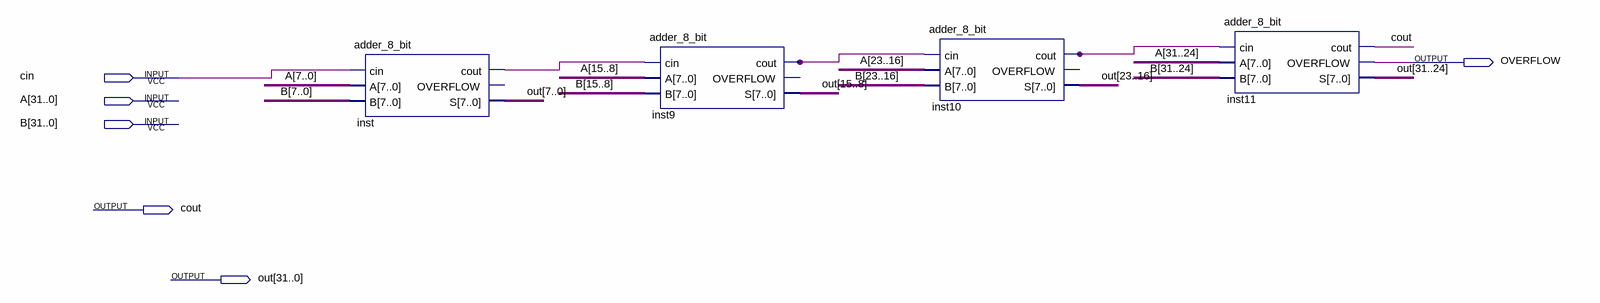
[diagram p0: schematic sheet]
// Quartus schematic adder_32_bit.bdf as structural Verilog: 4 symbols, 6 pins
module adder_32_bit (
  input  cin,
  input  [31:0] A,
  input  [31:0] B,
  output OVERFLOW,
  output cout,
  output [31:0] out
);

  wire inst9_cout, inst10_cout, inst_cout;

  adder_8_bit inst (.cin(cin), .A(A[7:0]), .B(B[7:0]), .cout(inst_cout), .S(out[7:0]));  // open: OVERFLOW
  adder_8_bit inst9 (.cin(inst_cout), .A(A[15:8]), .B(B[15:8]), .cout(inst9_cout), .S(out[15:8]));  // open: OVERFLOW
  adder_8_bit inst10 (
    .cin(inst9_cout), .A(A[23:16]), .B(B[23:16]), .cout(inst10_cout), .S(out[23:16]));  // open: OVERFLOW
  adder_8_bit inst11 (.cin(inst10_cout), .A(A[31:24]), .B(B[31:24]), .cout(cout), .OVERFLOW(OVERFLOW), .S(out[31:24]));
endmodule
